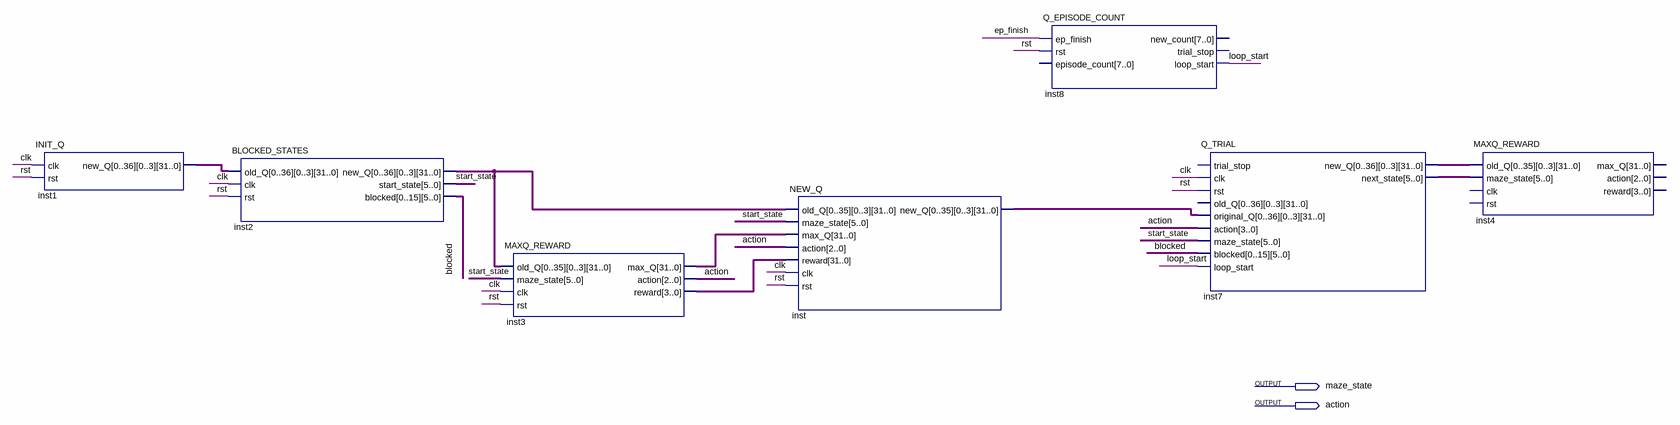
[diagram p0: schematic sheet]
// Quartus schematic Q_LEARN.bdf as structural Verilog: 7 symbols, 2 pins
module Q_LEARN (
  output maze_state,
  output action
);

  wire blocked, clk, ep_finish, loop_start, rst, start_state;
  wire [5:0] inst7_next_state;
  wire [31:0] inst3_max_q, inst3_reward;
  wire [4735:0] inst1_new_q, inst2_new_q, inst7_new_q, inst_new_q;

  INIT_Q inst1 (.clk(clk), .rst(rst), .new_Q(inst1_new_q));
  BLOCKED_STATES inst2 (
    .old_Q(inst1_new_q), .clk(clk), .rst(rst), .new_Q(inst2_new_q), .start_state(start_state),
    .blocked(blocked));
  MAXQ_REWARD inst3 (
    .old_Q(inst2_new_q), .maze_state({6{start_state}}), .clk(clk), .rst(rst), .max_Q(inst3_max_q),
    .action(action), .reward(inst3_reward));
  NEW_Q inst (
    .old_Q(inst2_new_q), .maze_state({6{start_state}}), .max_Q(inst3_max_q), .action({3{action}}),
    .reward(inst3_reward), .clk(clk), .rst(rst), .new_Q(inst_new_q));
  Q_EPISODE_COUNT inst8 (
    .ep_finish(ep_finish), .rst(rst), .loop_start(loop_start));  // open: episode_count, new_count, trial_stop
  Q_TRIAL inst7 (
    .clk(clk), .rst(rst), .original_Q(inst_new_q), .action({4{action}}), .maze_state({6{start_state}}),
    .blocked({96{blocked}}), .loop_start(loop_start), .new_Q(inst7_new_q), .next_state(inst7_next_state));  // open: trial_stop, old_Q
  MAXQ_REWARD inst4 (.old_Q(inst7_new_q), .maze_state(inst7_next_state));  // open: clk, rst, max_Q, action, reward
endmodule
